# EAGLE design CapstoneGroup9 (EAGLE 9.6.2)
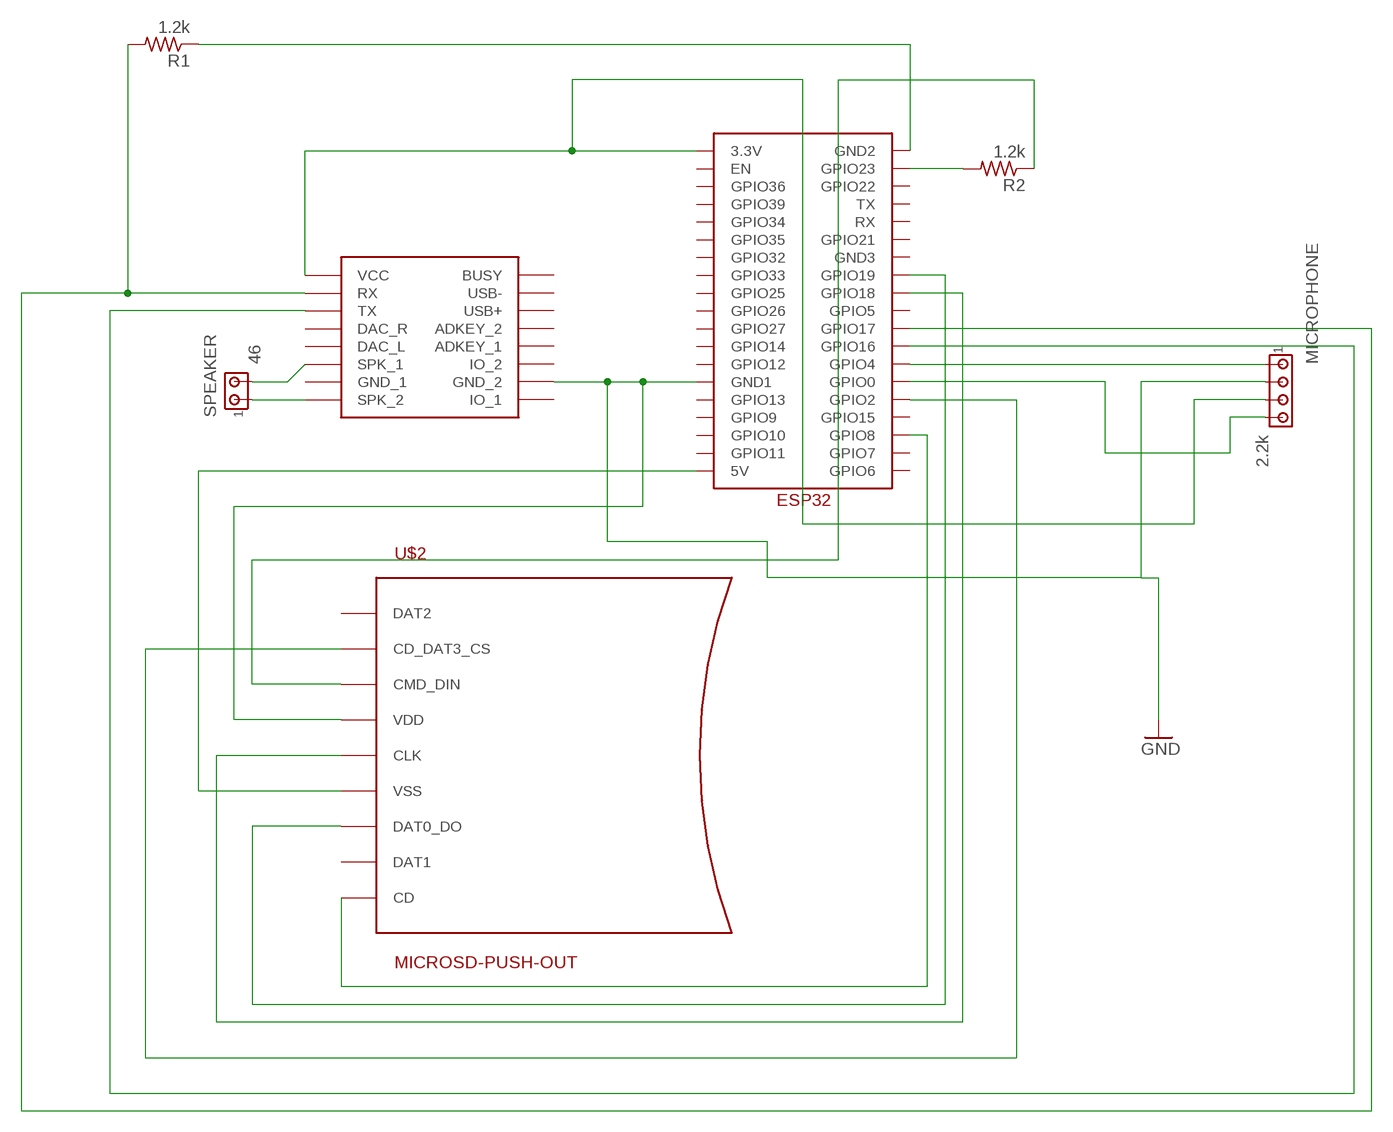
[diagram p0: schematic, sheet 1]

## Parts
DFPLAYERMINI  DFPLAYER  [DFPLAYER]
MICROPHONE  2.2k  MTA04-100  [10X04MTA]
R1  1.2k  R-US_0207/10  [0207/10]
R2  1.2k  R-US_0207/10  [0207/10]
SPEAKER  46  MTA02-100  [10X02MTA]
U$1  ESP32  [ESP32]
U$2  MICROSD-PUSH-OUT  [MICROSD-PUSH-OUT]

## Nets
GND: DFPLAYERMINI.GND_2 MICROPHONE.2 U$1.GND1 U$2.4(VDD)
N$1: DFPLAYERMINI.SPK2(SPK_2) SPEAKER.1
N$2: DFPLAYERMINI.SPK1(SPK_1) SPEAKER.2
N$3: DFPLAYERMINI.VCC MICROPHONE.3 U$1.3.3V
N$4: DFPLAYERMINI.RX R1.2 U$1.GPIO17
N$5: R2.2 U$1.GPIO23
N$6: DFPLAYERMINI.TX U$1.GPIO16
N$7: R1.1 U$1.GND2
N$8: MICROPHONE.1 U$1.GPIO4
N$9: MICROPHONE.4 U$1.GPIO0
N$10: U$1.5V U$2.6(VSS) U$2.G1(VSS) U$2.G2(VSS) U$2.G3(VSS) U$2.G4(VSS)
N$11: U$1.GPIO2 U$2.2(CD_DAT3_CS)
N$12: U$1.GPIO18 U$2.5(CLK)
N$13: U$1.GPIO8 U$2.CD
N$14: R2.1 U$2.3(CMD_DIN)
N$15: U$1.GPIO19 U$2.7(DAT0_DO)
Unconnected: DFPLAYERMINI.ADKEY1(ADKEY_1) DFPLAYERMINI.ADKEY2(ADKEY_2) DFPLAYERMINI.BUSY DFPLAYERMINI.DAC_L DFPLAYERMINI.DAC_R DFPLAYERMINI.GND_1 DFPLAYERMINI.IO1(IO_1) DFPLAYERMINI.IO2(IO_2) DFPLAYERMINI.USB+ DFPLAYERMINI.USB- U$1.EN U$1.GND3 U$1.GPIO5 U$1.GPIO6 U$1.GPIO7 U$1.GPIO9 U$1.GPIO10 U$1.GPIO11 U$1.GPIO12 U$1.GPIO13 U$1.GPIO14 U$1.GPIO15 U$1.GPIO21 U$1.GPIO22 U$1.GPIO25 U$1.GPIO26 U$1.GPIO27 U$1.GPIO32 U$1.GPIO33 U$1.GPIO34 U$1.GPIO35 U$1.GPIO36 U$1.GPIO39 U$1.RX U$1.TX U$2.1(DAT2) U$2.8(DAT1)

## Library data of the parts
DFPLAYERMINI = DFPlayer_v1:DFPLAYER
MICROPHONE = con-amp:MTA04-100: AMP connector
R1 R2 = rcl:R-US_: RESISTOR, American symbol; SPICEPREFIX: R
SPEAKER = con-amp:MTA02-100: AMP connector
U$1 = ESP32:ESP32
U$2 = microsd:MICROSD-PUSH-OUT: T-Flash Push-Out Micro SD Card Reader 14.75mm x 14.5mm SMD with external pins

## Board
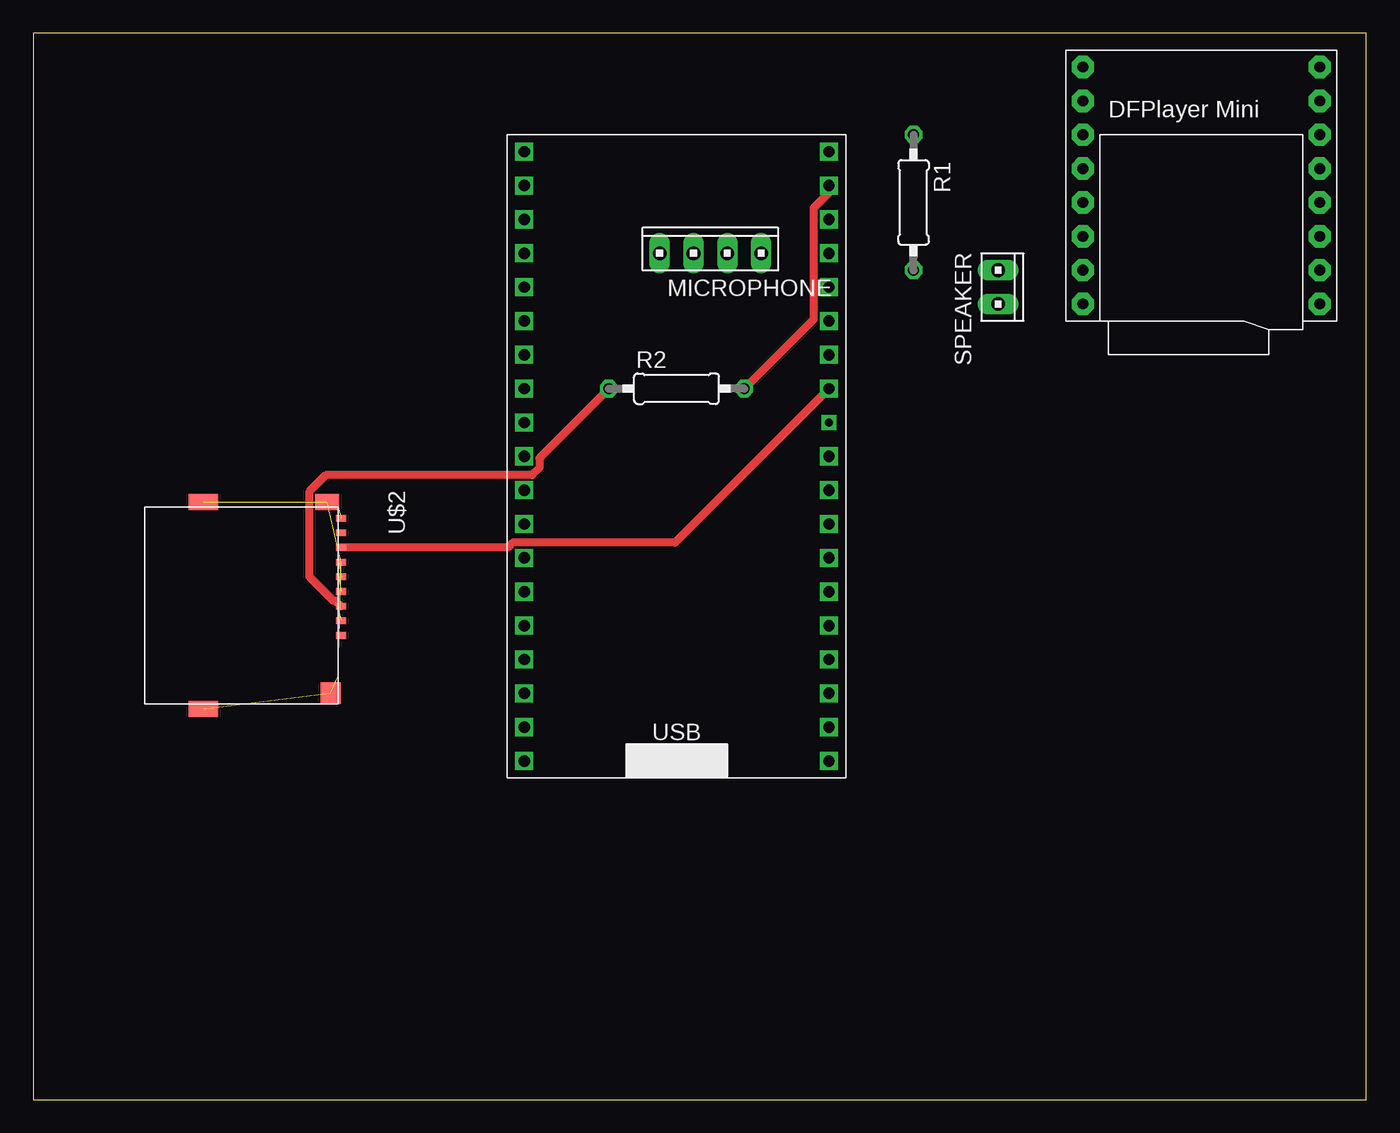
[diagram p1: board, top side]
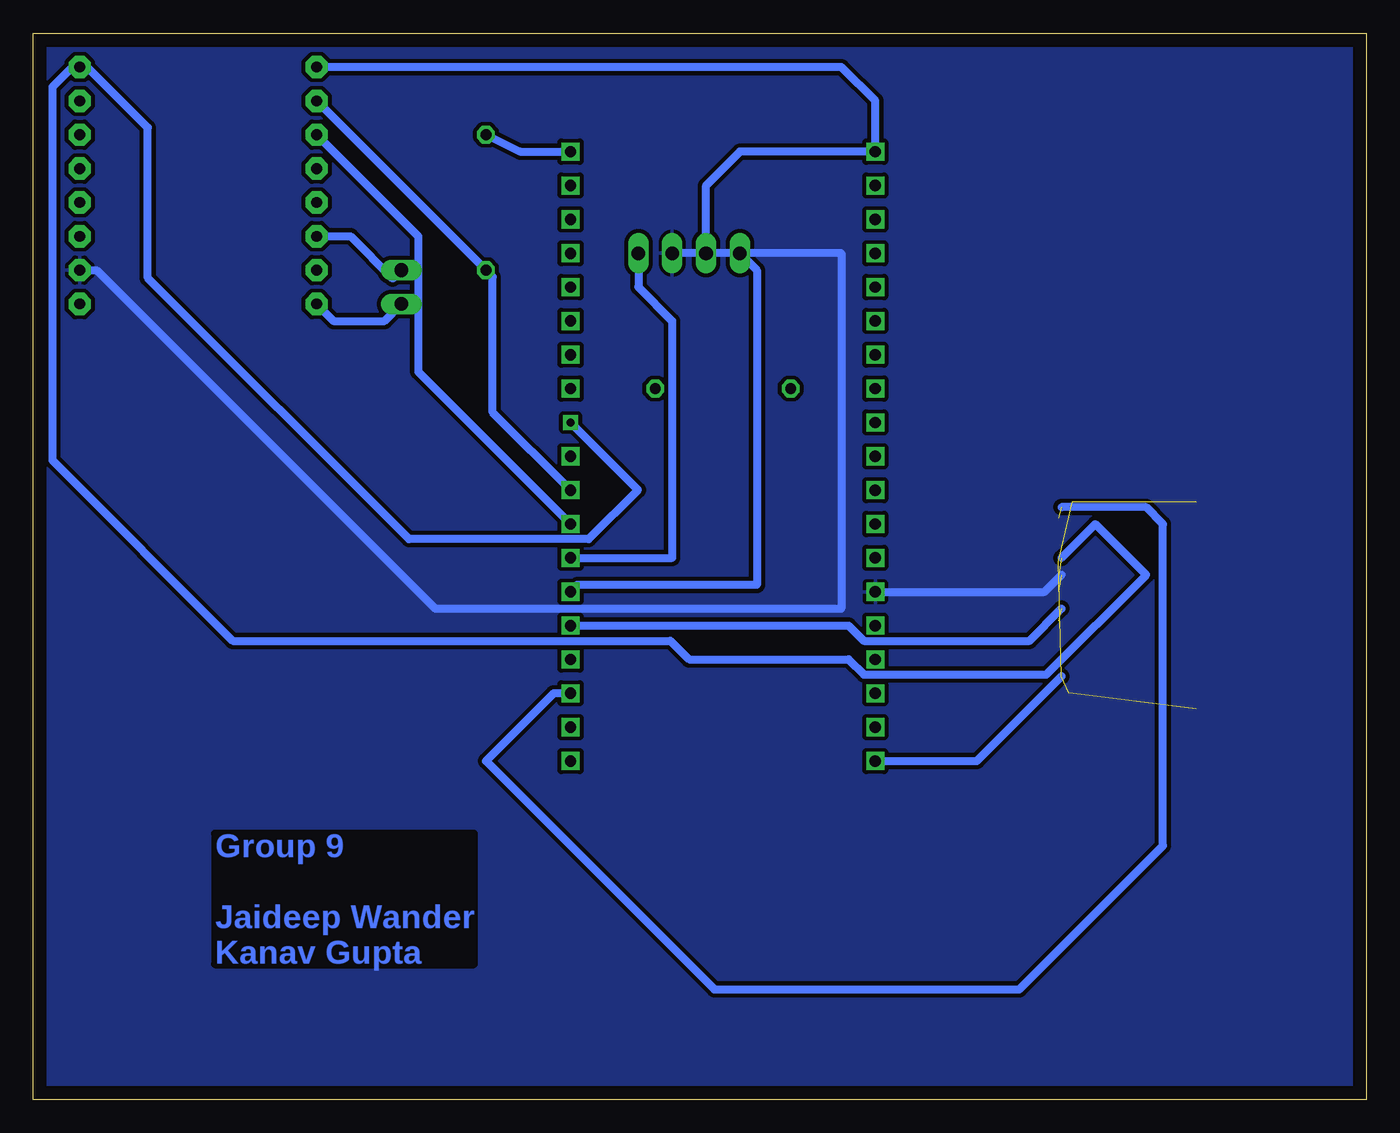
[diagram p2: board, bottom side, seen from below]

Size 100 x 80 mm. Coordinates in mm from the lower left corner, seen from the top.
Outline: 0,0 100,0 100,80 0,80 0,0
Copper layers (1*16): Top 0.035mm / dielectric 1.5mm / Bottom 0.035mm
Design rules "default *": minimum track width 6mil, minimum drill 0.35mm, track to track 12mil, track to pad 12mil, pad to pad 8mil, via to via 8mil, smd to smd 8mil, copper to edge 40mil, drill to drill 6mil, minimum pad ring 10mil, minimum via ring 8mil, stop-mask expansion 4mil, vias tented up to drill 0mil, thermal gap 10mil

### Footprints (pad centres in the part's own frame; a part is rotated, then mirrored left to right if it is on the bottom)
DFPLAYER = drill 0.8 pad 1.676 octagon: ADKEY1 8.89,-1.27; ADKEY2 8.89,1.27; BUSY 8.89,8.89; DAC_L -8.89,-1.27; DAC_R -8.89,1.27; GND_1 -8.89,-6.35; GND_2 8.89,-6.35; IO1 8.89,-8.89; IO2 8.89,-3.81; RX -8.89,6.35; SPK1 -8.89,-3.81; SPK2 -8.89,-8.89; TX -8.89,3.81; USB+ 8.89,3.81; USB- 8.89,6.35; VCC -8.89,8.89
10X04MTA = drill 1.016 long: 1 3.81,0; 2 1.27,0; 3 -1.27,0; 4 -3.81,0
0207/10 = drill 0.813 octagon: 1 -5.08,0; 2 5.08,0
10X02MTA = drill 1.016 long: 1 1.27,0; 2 -1.27,0
ESP32 = drill 0.85 square: 3.3V 1.27,46.99; 5V 1.27,1.27; EN 1.27,44.45; GND1 1.27,13.97; GND2 24.13,46.99; GND3 24.13,31.75; GPIO0 24.13,13.97; GPIO2 24.13,11.43; GPIO4 24.13,16.51; GPIO5 24.13,24.13; GPIO6 24.13,1.27; GPIO7 24.13,3.81; GPIO8 24.13,6.35; GPIO9 1.27,8.89; GPIO10 1.27,6.35; GPIO11 1.27,3.81; GPIO12 1.27,16.51; GPIO13 1.27,11.43; GPIO14 1.27,19.05; GPIO15 24.13,8.89; GPIO16 24.13,19.05; GPIO17 24.13,21.59; GPIO19 24.13,29.21; GPIO21 24.13,34.29; GPIO22 24.13,41.91; GPIO23 24.13,44.45; GPIO25 1.27,26.67; GPIO26 1.27,24.13; GPIO27 1.27,21.59; GPIO32 1.27,31.75; GPIO33 1.27,29.21; GPIO34 1.27,36.83; GPIO35 1.27,34.29; GPIO36 1.27,41.91; GPIO39 1.27,39.37; RX 24.13,36.83; TX 24.13,39.37 | drill 0.6 square: GPIO18 24.13,26.67
MICROSD-PUSH-OUT = smd 0.5 x 0.75: 1 9.625,0.225; 2 8.525,0.225; 3 7.425,0.225; 4 6.325,0.225; 5 5.225,0.225; 6 4.125,0.225; 7 3.025,0.225; 8 1.925,0.225; CD 0.825,0.225 | smd 1.2 x 1.8: G1 -0.375,-0.8 | smd 1.2 x 2.2: G2 -0.375,-10.1; G4 15.125,-10.1 | smd 1.6 x 1.5: G3 13.95,-0.55

### Placement (x,y rotation side)
DFPLAYERMINI  87.63,68.58 0 top
MICROPHONE  50.8,63.5 0 top
R1  66.04,67.31 270 top
R2  48.26,53.34 0 top
SPEAKER  72.39,60.96 270 top
U$1  35.56,24.13 0 top
U$2  22.86,44.45 270 top

### Tracks (layer width: path | path; a pad name or v marks a point on that pad's centre or on a via)
GND  (1 unrouted)
  Bottom 0.61: MICROPHONE.2 39.37,63.5 39.37,36.83 69.85,36.83 95.25,62.23 DFPLAYERMINI.GND_2 | U$1.GND1 24.13,38.1 22.86,39.37
  pour Bottom (isolate 0.001): 0,0 100.33,0 100.33,80.01 0,80.01
N$1
  Bottom 0.61: DFPLAYERMINI.SPK2 77.47,58.42 73.66,58.42 SPEAKER.1
N$2
  Bottom 0.61: DFPLAYERMINI.SPK1 76.2,64.77 73.03,61.59 SPEAKER.2
N$3
  Bottom 0.61: DFPLAYERMINI.VCC 39.37,77.47 36.83,74.93 U$1.3.3V 46.99,71.12 49.53,68.58 MICROPHONE.3
N$4
  Bottom 0.61: U$1.GPIO17 65.53,51.56 65.53,61.72 R1.2 DFPLAYERMINI.RX
N$5
  Top 0.61: R2.2 58.55,58.55 58.55,66.91 59.69,68.05 U$1.GPIO23
N$6
  Bottom 0.61: U$1.GPIO16 71.12,54.61 71.12,64.77 DFPLAYERMINI.TX
N$7
  Bottom 0.61: R1.1 63.5,71.12 U$1.GND2
N$8
  Bottom 0.61: MICROPHONE.1 54.61,60.96 52.07,58.42 52.07,40.64 U$1.GPIO4
N$9
  Bottom 0.61: U$1.GPIO0 59.18,38.61 45.72,38.61 45.72,62.23 MICROPHONE.4
N$10  (5 unrouted)
  Bottom 0.61: U$1.5V 29.21,25.4 22.86,31.75
N$11  (1 unrouted)
  Bottom 0.61: U$1.GPIO2 38.84,35.56 37.7,34.42 25.27,34.42 22.86,36.83
N$12  (1 unrouted)
  Bottom 0.61: U$1.GPIO18 54.64,45.75 58.34,42.04 71.82,42.04 91.42,61.64 91.42,72.93 95.98,77.5 97.06,77.5 98.58,75.97 98.58,47.97 85.03,34.42 52.2,34.42 50.8,33.02 38.84,33.02 37.7,31.88 24,31.88 16.51,39.37 20.32,43.18 22.86,40.64
N$13  (1 unrouted)
  Bottom 0.61: U$1.GPIO8 60.96,30.48 66.04,25.4 48.9,8.26 26.04,8.26 15.24,19.05 15.24,43.18 16.51,44.45 22.86,44.45
N$14
  Top 0.61: R2.1 37.97,48.13 37.97,47.39 37.43,46.86 21.95,46.86 20.7,45.61 20.7,39.24 22.52,37.42 22.69,37.42 U$2.3
N$15
  Top 0.61: U$2.7 35.61,41.42 35.96,41.78 48.13,41.78 U$1.GPIO19

### Text on the board
Bottom: Group 9 / / Jaideep Wander / Kanav Gupta